# EAGLE design ArcadeMachine (EAGLE 9.2.0)
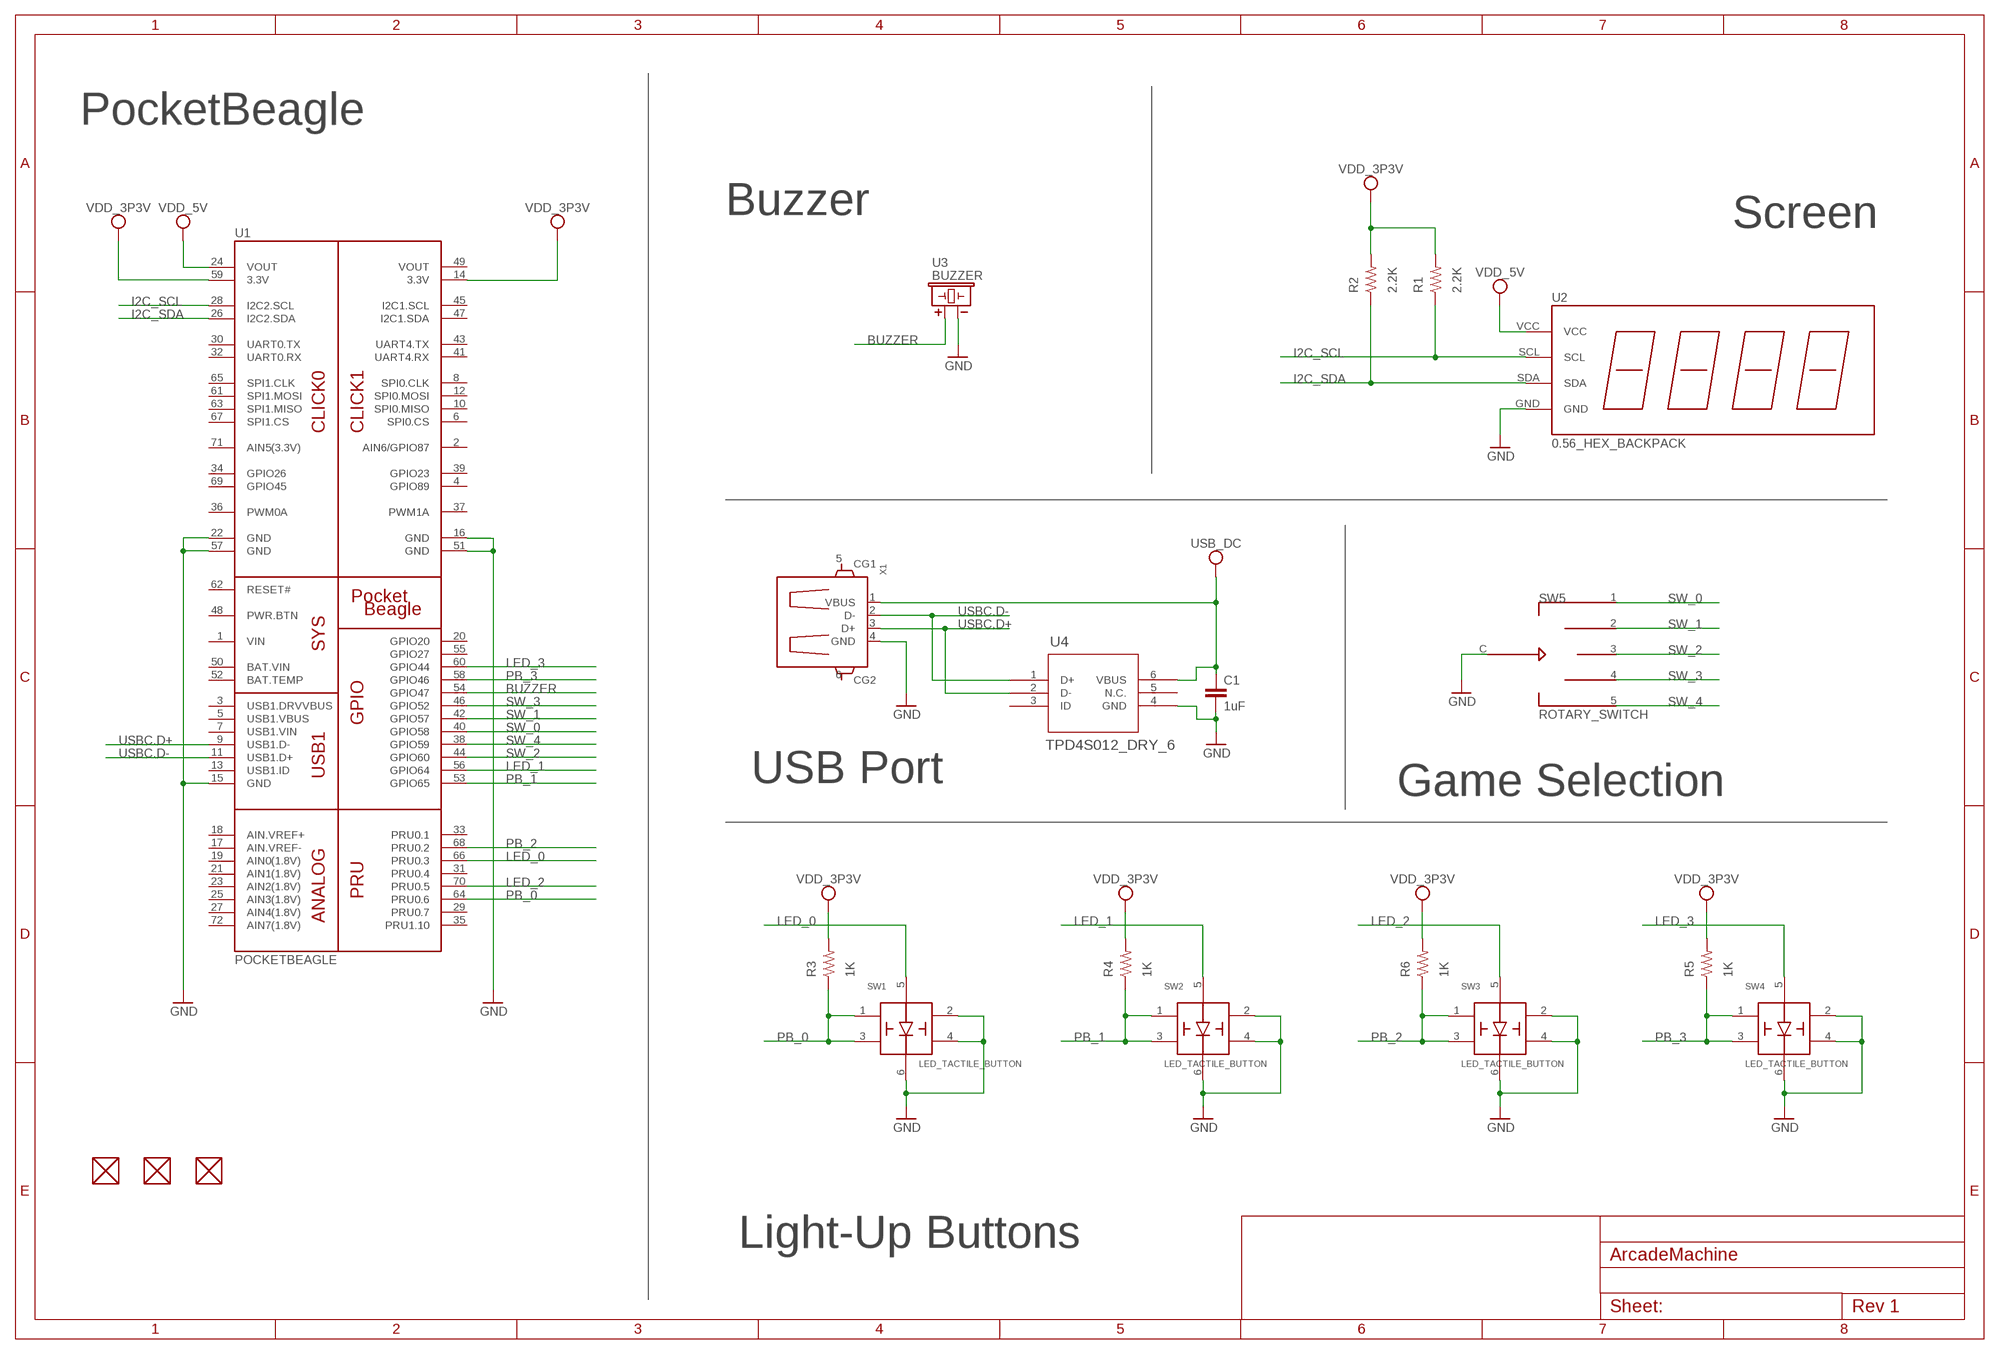
[diagram p0: schematic, sheet 1]

## Parts
C1  1uF  SPARKFUN-CAPACITORS_CAP0603-CAP  [SPARKFUN-CAPACITORS_0603-CAP]
FUD1  FIDUCIAL  [FIDUCIAL_40MIL]
FUD2  FIDUCIAL  [FIDUCIAL_40MIL]
FUD3  FIDUCIAL  [FIDUCIAL_40MIL]
R1  2.2K  R_R0603  [R0603]
R2  2.2K  R_R0603  [R0603]
R3  1K  R_R0603  [R0603]
R4  1K  R_R0603  [R0603]
R5  1K  R_R0603  [R0603]
R6  1K  R_R0603  [R0603]
SW1  LED_TACTILE_BUTTON  [LED_TACTILE_BUTTON]
SW2  LED_TACTILE_BUTTON  [LED_TACTILE_BUTTON]
SW3  LED_TACTILE_BUTTON  [LED_TACTILE_BUTTON]
SW4  LED_TACTILE_BUTTON  [LED_TACTILE_BUTTON]
SW5  ROTARY_SWITCH  [ROTARY_SWITCH]
U1  POCKETBEAGLE  [POCKETBEAGLE]
U2  0.56_HEX_BACKPACK  [0.56_HEX_BACKPACK]
U3  BUZZER  [BUZZER_6.5MM]
U4  TPD4S012_DRY_6  [BEAGLEBONE_BLUE_DRY6]
X1  GHI2_USB_HOST_W/CHASSIS_GND  [GHI2_USB_HOST_HORIZONTAL_W/CHASSIS_GND]

## Nets
BUZZER: U1.54(GPIO47) U3.+
GND: C1.2 SW1.2 SW1.4 SW1.6 SW2.2 SW2.4 SW2.6 SW3.2 SW3.4 SW3.6 SW4.2 SW4.4 SW4.6 SW5.C U1.15(GND) U1.16(GND) U1.22(GND) U1.51(GND) U1.57(GND) U2.GND U3.- U4.4(GND) X1.4(GND)
I2C_SCL: R1.1 U1.28(I2C2.SCL) U2.SCL
I2C_SDA: R2.1 U1.26(I2C2.SDA) U2.SDA
LED_0: SW1.5 U1.66(PRU0.3)
LED_1: SW2.5 U1.56(GPIO64)
LED_2: SW3.5 U1.70(PRU0.5)
LED_3: SW4.5 U1.60(GPIO44)
PB_0: R3.1 SW1.1 SW1.3 U1.64(PRU0.6)
PB_1: R4.1 SW2.1 SW2.3 U1.53(GPIO65)
PB_2: R6.1 SW3.1 SW3.3 U1.68(PRU0.2)
PB_3: R5.1 SW4.1 SW4.3 U1.58(GPIO46)
SW_0: SW5.1 U1.40(GPIO58)
SW_1: SW5.2 U1.42(GPIO57)
SW_2: SW5.3 U1.44(GPIO60)
SW_3: SW5.4 U1.46(GPIO52)
SW_4: SW5.5 U1.38(GPIO59)
USB_DC: C1.1 U4.6(VBUS) X1.1(VBUS)
USBC.D+: U1.9(USB1.D-) U4.2(D-) X1.3(D+)
USBC.D-: U1.11(USB1.D+) U4.1(D+) X1.2(D-)
VDD_3P3V: R1.2 R2.2 R3.2 R4.2 R5.2 R6.2 U1.14(3.3V) U1.59(3.3V)
VDD_5V: U1.24(VOUT) U2.VCC
Unconnected: FUD1.P$1 FUD2.P$1 FUD3.P$1 U1.2(AIN6/GPIO87) U1.3(USB1.DRVVBUS) U1.4(GPIO89) U1.5(USB1.VBUS) U1.6(SPI0.CS) U1.7(USB1.VIN) U1.8(SPI0.CLK) U1.10(SPI0.MISO) U1.12(SPI0.MOSI) U1.13(USB1.ID) U1.17(AIN.VREF-) U1.18(AIN.VREF+) U1.19(AIN0(1.8V)) U1.20(GPIO20) U1.21(AIN1(1.8V)) U1.23(AIN2(1.8V)) U1.25(AIN3(1.8V)) U1.27(AIN4(1.8V)) U1.29(PRU0.7) U1.30(UART0.TX) U1.31(PRU0.4) U1.32(UART0.RX) U1.33(PRU0.1) U1.34(GPIO26) U1.35(PRU1.10) U1.36(PWM0A) U1.37(PWM1A) U1.39(GPIO23) U1.41(UART4.RX) U1.43(UART4.TX) U1.45(I2C1.SCL) U1.47(I2C1.SDA) U1.48(PWR.BTN) U1.52(BAT.TEMP) U1.55(GPIO27) U1.61(SPI1.MOSI) U1.62(RESET#) U1.63(SPI1.MISO) U1.65(SPI1.CLK) U1.67(SPI1.CS) U1.69(GPIO45) U1.71(AIN5(3.3V)) U1.72(AIN7(1.8V)) U4.3(ID) U4.5(N.C.) X1.5(CG1) X1.6(CG2)

## Notes on the sheet
- PocketBeagle
- Buzzer | Screen
- USB Port | Game Selection
- Light-Up Buttons

## Power pins joined to a net without a drawn wire
BAT.VIN: U1.50(BAT.VIN)
VIN: U1.1(VIN)
VOUT: U1.49(VOUT)

## Library data of the parts
C1 = ArcadeMachine:SPARKFUN-CAPACITORS_CAP: Capacitor Standard 0603 ceramic capacitor, and 0.1" leaded capacitor.
FUD1-FUD3 = ArcadeMachine:FIDUCIAL
R1 R2 = ENGI301:R_: RESISTOR, American symbol
R3-R6 = ArcadeMachine:R_: RESISTOR, American symbol
SW1-SW4 = ArcadeMachine:LED_TACTILE_BUTTON
SW5 = ArcadeMachine:ROTARY_SWITCH
U1 = ArcadeMachine:POCKETBEAGLE
U2 = ArcadeMachine:0.56_HEX_BACKPACK: 0.56" LED HEX Backback - Adafruit HT16K33 - https://www.adafruit.com/product/878 - https://www.adafruit.com/product/879 - https://www.adafruit.com/product/880 - https://www.adafruit.com/product/881 - https://www.adafruit.com/product/1002
U3 = ArcadeMachine:BUZZER: CEM-1203 Buzzer
U4 = ArcadeMachine:TPD4S012_DRY_6; DATASHEETURL: http://www.ti.com/lit/gpn/TPD4S012; DESCRIPTION: 4-Channel USB ESD Solution with Power Clamp; FAMILY_NAME: ESD Solution; GENERIC_PART_NUMBER: TPD4S012; INDUSTRY_STD_PKG_TYPE: SON; MANUFACTURER: Texas Instruments; MANUFACTURER_PART_NUMBER: tpd4s012_dry_6; PACKAGE_DESIGNATOR: DRY; PIN_COUNT: 6; VENDOR: Texas Instruments
X1 = ArcadeMachine:GHI2_USB_HOST_W/CHASSIS_GND

## Board
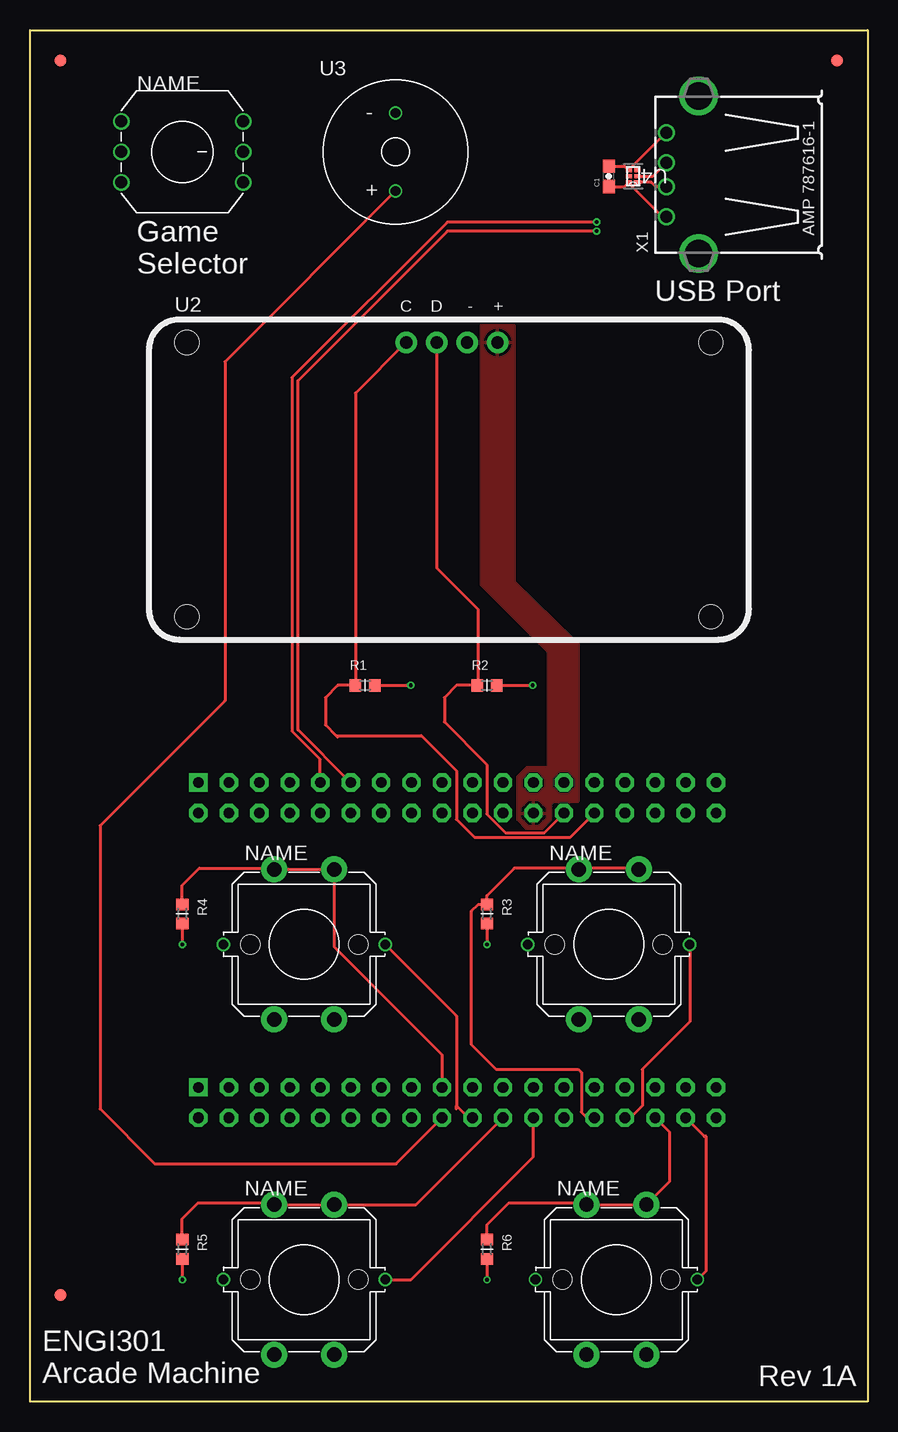
[diagram p1: board, top side]
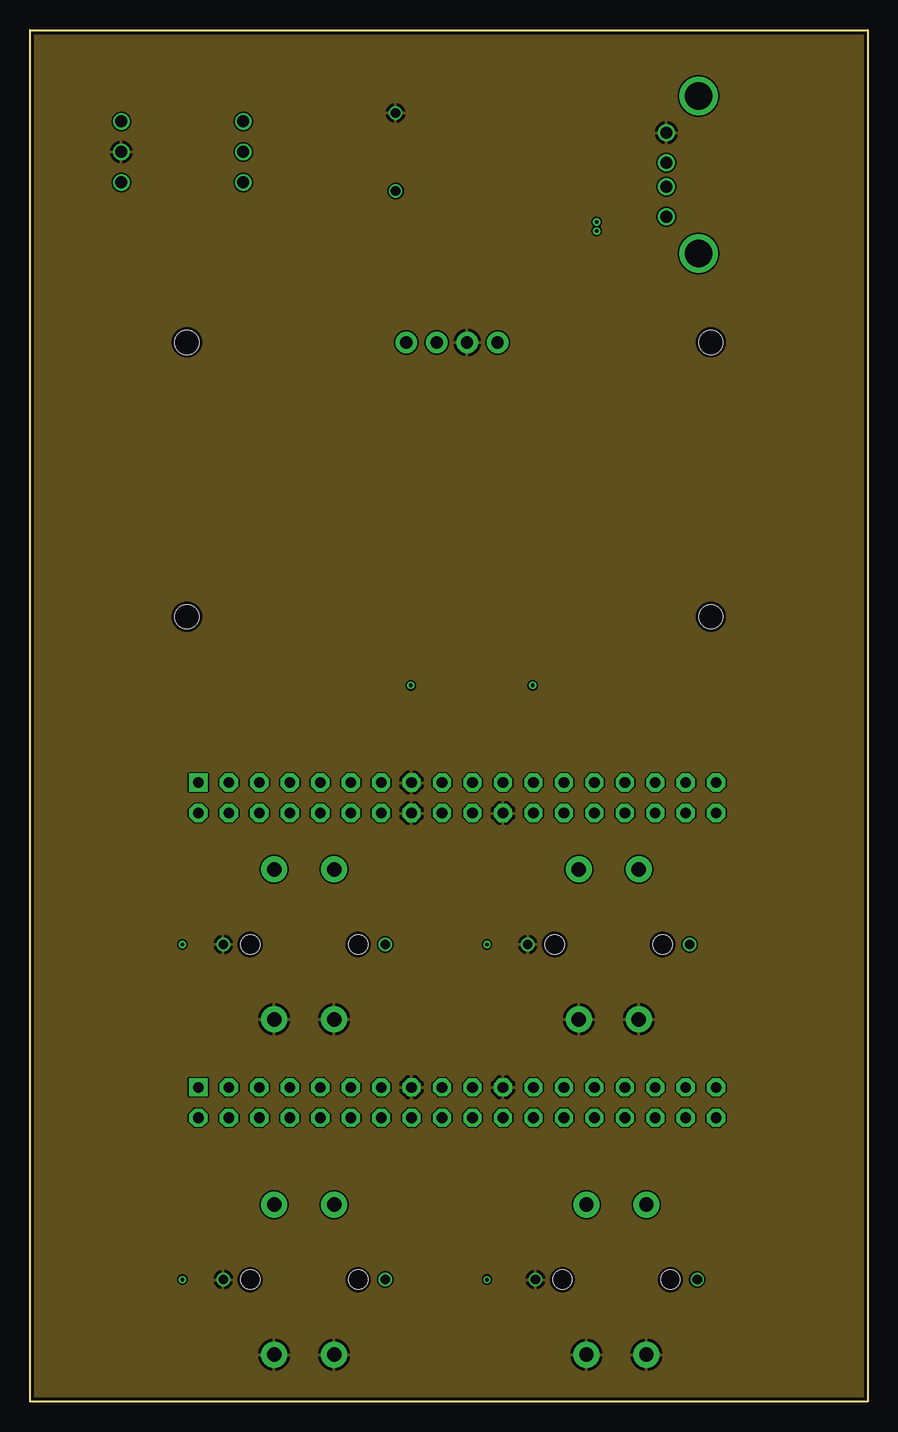
[diagram p2: board, inner layer Route2]
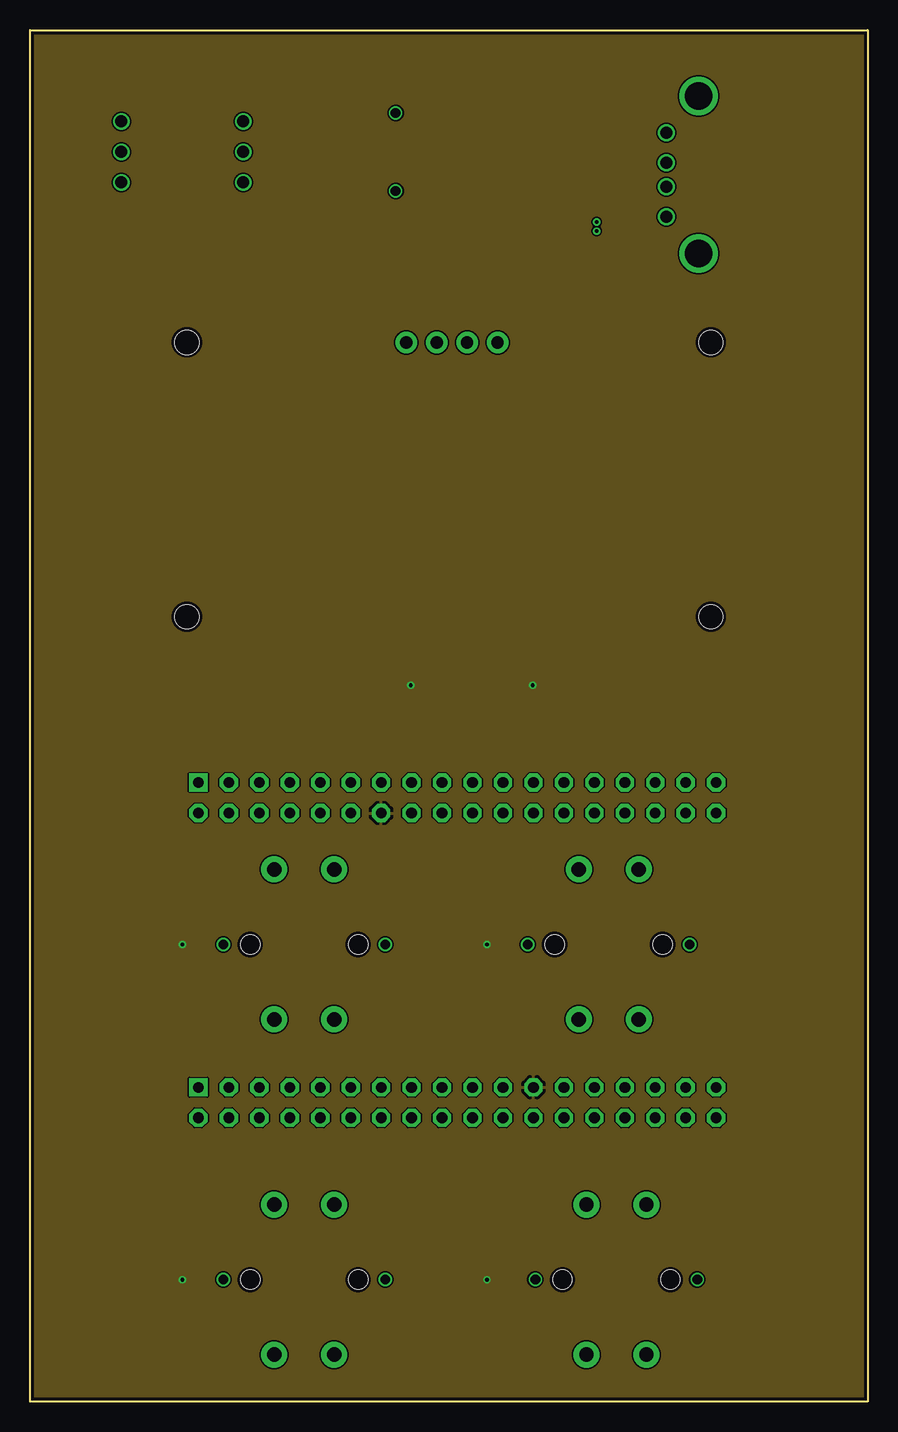
[diagram p3: board, inner layer Route15]
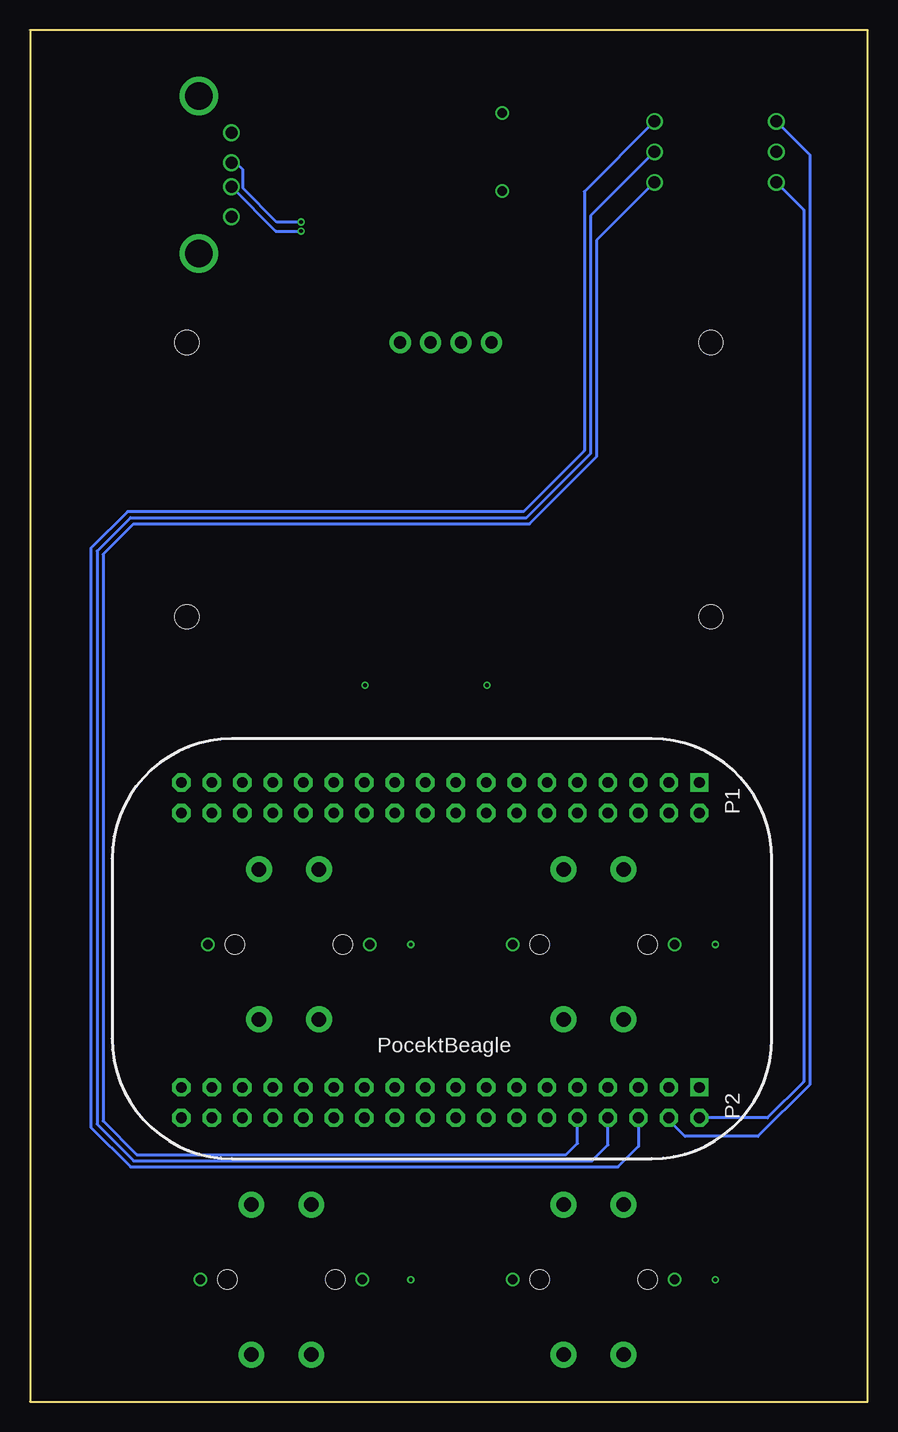
[diagram p4: board, bottom side, seen from below]

Size 69.85 x 114.3 mm. Coordinates in mm from the lower left corner, seen from the top.
Outline: 0,0 0,114.3 69.85,114.3 69.85,0 0,0
Copper layers (1*2*15*16): Top 0.035mm / dielectric 0.23mm / Route2 0.035mm / dielectric 0.93mm / Route15 0.035mm / dielectric 0.23mm / Bottom 0.035mm
Design rules "ENGI301_4lyr *": minimum track width 10mil, minimum drill 12mil, track to track 5mil, track to pad 5mil, pad to pad 5mil, via to via 5mil, smd to smd 5mil, copper to edge 10mil, drill to drill 12mil, minimum pad ring 6mil, minimum via ring 6mil, stop-mask expansion 3mil, vias tented up to drill 25mil, thermal gap 10mil

### Footprints (pad centres in the part's own frame; a part is rotated, then mirrored left to right if it is on the bottom)
SPARKFUN-CAPACITORS_0603-CAP = smd 1.1 x 1: 1 -0.85,0; 2 0.85,0
FIDUCIAL_40MIL = smd 1.016 x 1.016: P$1 0,0
R0603 = smd 0.95 x 1.031: 1 -0.8,0; 2 0.8,0
LED_TACTILE_BUTTON = drill 1.2 pad 2.159: 1 2.5,6.25; 2 2.5,-6.25; 3 -2.5,6.25; 4 -2.5,-6.25 | drill 0.8: 5 6.75,0; 6 -6.75,0 | hole 1.6: -4.5,0; 4.5,0
ROTARY_SWITCH = drill 0.991: 1 -5.08,2.54; 2 5.08,2.54; 3 5.08,0; 4 5.08,-2.54; 5 -5.08,-2.54; C -5.08,0
POCKETBEAGLE = drill 0.889 pad 1.524 square: 1 5.91,3.53; 37 5.91,28.93 | drill 0.889 pad 1.524 octagon: 2 5.91,6.07; 3 8.45,3.53; 4 8.45,6.07; 5 10.99,3.53; 6 10.99,6.07; 7 13.53,3.53; 8 13.53,6.07; 9 16.07,3.53; 10 16.07,6.07; 11 18.61,3.53; 12 18.61,6.07; 13 21.15,3.53; 14 21.15,6.07; 15 23.69,3.53; 16 23.69,6.07; 17 26.23,3.53; 18 26.23,6.07; 19 28.77,3.53; 20 28.77,6.07; 21 31.31,3.53; 22 31.31,6.07; 23 33.85,3.53; 24 33.85,6.07; 25 36.39,3.53; 26 36.39,6.07; 27 38.93,3.53; 28 38.93,6.07; 29 41.47,3.53; 30 41.47,6.07; 31 44.01,3.53; 32 44.01,6.07; 33 46.55,3.53; 34 46.55,6.07; 35 49.09,3.53; 36 49.09,6.07; 38 5.91,31.47; 39 8.45,28.93; 40 8.45,31.47; 41 10.99,28.93; 42 10.99,31.47; 43 13.53,28.93; 44 13.53,31.47; 45 16.07,28.93; 46 16.07,31.47; 47 18.61,28.93; 48 18.61,31.47; 49 21.15,28.93; 50 21.15,31.47; 51 23.69,28.93; 52 23.69,31.47; 53 26.23,28.93; 54 26.23,31.47; 55 28.77,28.93; 56 28.77,31.47; 57 31.31,28.93; 58 31.31,31.47; 59 33.85,28.93; 60 33.85,31.47; 61 36.39,28.93; 62 36.39,31.47; 63 38.93,28.93; 64 38.93,31.47; 65 41.47,28.93; 66 41.47,31.47; 67 44.01,28.93; 68 44.01,31.47; 69 46.55,28.93; 70 46.55,31.47; 71 49.09,28.93; 72 49.09,31.47
0.56_HEX_BACKPACK = drill 1.016 pad 1.778: GND 1.524,11.43; SCL -3.556,11.43; SDA -1.016,11.43; VCC 4.064,11.43 | hole 2: -21.844,-11.43; 21.844,-11.43; -21.844,11.43; 21.844,11.43
BUZZER_6.5MM = drill 0.8: + 0,-3.25; - 0,3.25
BEAGLEBONE_BLUE_DRY6 = smd 0.559 x 0.305: 1 -0.355,0.5 | smd 0.508 x 0.305: 2 -0.37,0; 3 -0.37,-0.5; 4 0.37,-0.5; 5 0.37,0; 6 0.37,0.5
GHI2_USB_HOST_HORIZONTAL_W/CHASSIS_GND = drill 1: 1 -3.5,12.99; 2 -1,12.99; 3 1,12.99; 4 3.5,12.99 | drill 2.3: 5 -6.57,10.28; 6 6.57,10.28

### Placement (x,y rotation side)
C1  48.26,102.11 90 top
FUD1  2.54,111.76 0 top
FUD2  67.31,111.76 0 top
FUD3  2.54,8.89 0 top
R1  27.94,59.69 0 top
R2  38.1,59.69 0 top
R3  38.1,40.64 270 top
R4  12.7,40.64 270 top
R5  12.7,12.7 270 top
R6  38.1,12.7 270 top
SW1  48.26,38.1 0 top
SW2  22.86,38.1 0 top
SW3  48.9,10.16 0 top
SW4  22.86,10.16 0 top
SW5  12.7,104.14 0 top
U1  8.13,55.12 180 bottom
U2  34.92,76.83 0 top
U3  30.48,104.14 0 top
U4  50.29,102.11 180 top
X1  66.04,102.23 90 top

### Tracks (layer width: path | path; a pad name or v marks a point on that pad's centre or on a via)
BUZZER
  Top 0.254: U3.+ 16.26,86.67 16.26,58.42 5.84,48.01 5.84,24.38 10.41,19.81 30.52,19.81 U1.54
GND
  Top 0.254: C1.2 49.57,102.96 U4.4 50.15,102.84 50.15,102.87 53.02,105.73 X1.4
  pour Route2: -2.54,-2.54 -2.54,116.84 72.39,116.84 72.39,-2.54
I2C_SCL
  Top 0.254: 25.53,55.5 24.64,56.39 24.64,58.67 25.65,59.69 R1.1 27.14,84.04 U2.SCL | 25.53,55.5 25.65,55.37 | 25.53,55.5 32.64,55.5 35.56,52.58 35.56,48.51 37.08,46.99 45,46.99 U1.28
I2C_SDA
  Top 0.254: U2.SDA 33.91,69.47 37.34,66.04 37.34,59.73 R2.1 35.56,59.69 34.54,58.67 34.54,56.64 38.1,53.09 38.1,48.95 39.68,47.37 42.84,47.37 U1.26
LED_0
  Top 0.254: SW1.5 55.01,31.64 51.05,27.69 51.05,24.64 50.06,23.65 U1.66
LED_1
  Top 0.254: SW2.5 35.56,32.15 35.56,24.64 | 35.56,24.38 35.56,24.64 | 35.56,24.64 36.55,23.65 U1.56
LED_2
  Top 0.254: SW3.5 56.39,10.9 56.39,22.1 56.23,22.1 U1.70
LED_3
  Top 0.254: SW4.5 31.75,10.16 41.98,20.39 U1.60
PB_0
  Top 0.254: SW1.1 50.66,44.45 45.76,44.45 SW1.3 45.76,44.41 45.72,44.45 40.39,44.45 38.1,42.16 R3.1 37.38,41.44 36.83,40.89 36.83,29.72 38.86,27.69 45.72,27.69 45.97,27.43 45.97,24.13 46.46,23.65 U1.64
PB_1
  Top 0.254: R4.1 12.7,43.03 14.12,44.45 20.26,44.45 SW2.3 SW2.1 25.36,37.89 34.36,28.89 U1.53
PB_2
  Top 0.254: U1.68 53.34,22.45 53.34,18.36 SW3.1 SW3.3 46.3,16.51 39.88,16.51 38.1,14.73 R6.1
PB_3
  Top 0.254: U1.58 32.2,16.41 SW4.1 SW4.3 20.26,16.51 13.97,16.51 12.7,15.24 R5.1
SW_0
  Bottom 0.254: SW5.1 4.83,103.89 4.83,26.42 9.14,22.1 15.24,22.1 16.58,23.44 U1.40
SW_1
  Bottom 0.254: SW5.2 23.62,100.84 23.62,79.25 28.7,74.17 61.72,74.17 64.77,71.12 64.77,22.86 61.47,19.56 20.83,19.56 19.12,21.27 U1.42
SW_2
  Bottom 0.254: SW5.3 23.11,98.81 23.11,78.99 28.45,73.66 61.47,73.66 64.26,70.87 64.26,23.11 61.21,20.07 22.99,20.07 21.66,21.39 U1.44
SW_3
  Bottom 0.254: SW5.4 22.61,96.77 22.61,78.74 28.19,73.15 61.21,73.15 63.75,70.61 63.75,23.38 60.95,20.57 25.15,20.57 24.2,21.52 U1.46
SW_4
  Bottom 0.254: SW5.5 5.33,99.31 5.33,26.67 8.36,23.65 U1.38
USB_DC
  Top 0.254: C1.1 49.57,101.26 U4.6 50.11,101.42 50.11,101.35 52.73,98.73 X1.1
USBC.D+  (via drill 0.3)
  Top 0.254: U4.2 51.92,102.11 X1.3 | U1.9 24.2,53.53 21.84,55.88 21.84,85.34 34.8,98.3 v47.24,98.3
  Bottom 0.254: v47.24,98.3 49.28,98.3 52.1,101.12 52.1,102.65 52.69,103.23 X1.3
USBC.D-  (via drill 0.3)
  Top 0.254: X1.2 52.18,101.23 51.81,101.61 U4.1 | U1.11 22.35,55.97 22.35,85.09 34.8,97.54 v47.24,97.54
  Bottom 0.254: v47.24,97.54 49.35,97.54 X1.2
VDD_3P3V  (via drill 0.3)
  Top 0.254: R4.2 v12.7,38.1 | R5.2 v12.7,10.16 | R3.2 v38.1,38.1 | R6.2 v38.1,10.16 | R1.2 v31.75,59.69 | R2.2 v41.91,59.69
  pour Route15: -5.08,-5.08 -5.08,119.38 74.93,119.38 74.93,-5.08
VDD_5V
  pour Top: 37.59,89.66 37.59,68.07 43.18,62.48 43.18,52.83 41.4,52.83 40.64,52.07 40.64,48.51 41.4,47.75 42.67,47.75 43.43,48.51 43.43,49.78 43.69,50.04 45.72,50.04 45.72,57.91 45.72,63.12 45.34,63.5 40.39,68.33 40.39,89.66

### Text on the board
tNames: Game / Selector | USB Port | ENGI301 / Arcade Machine | Rev 1A